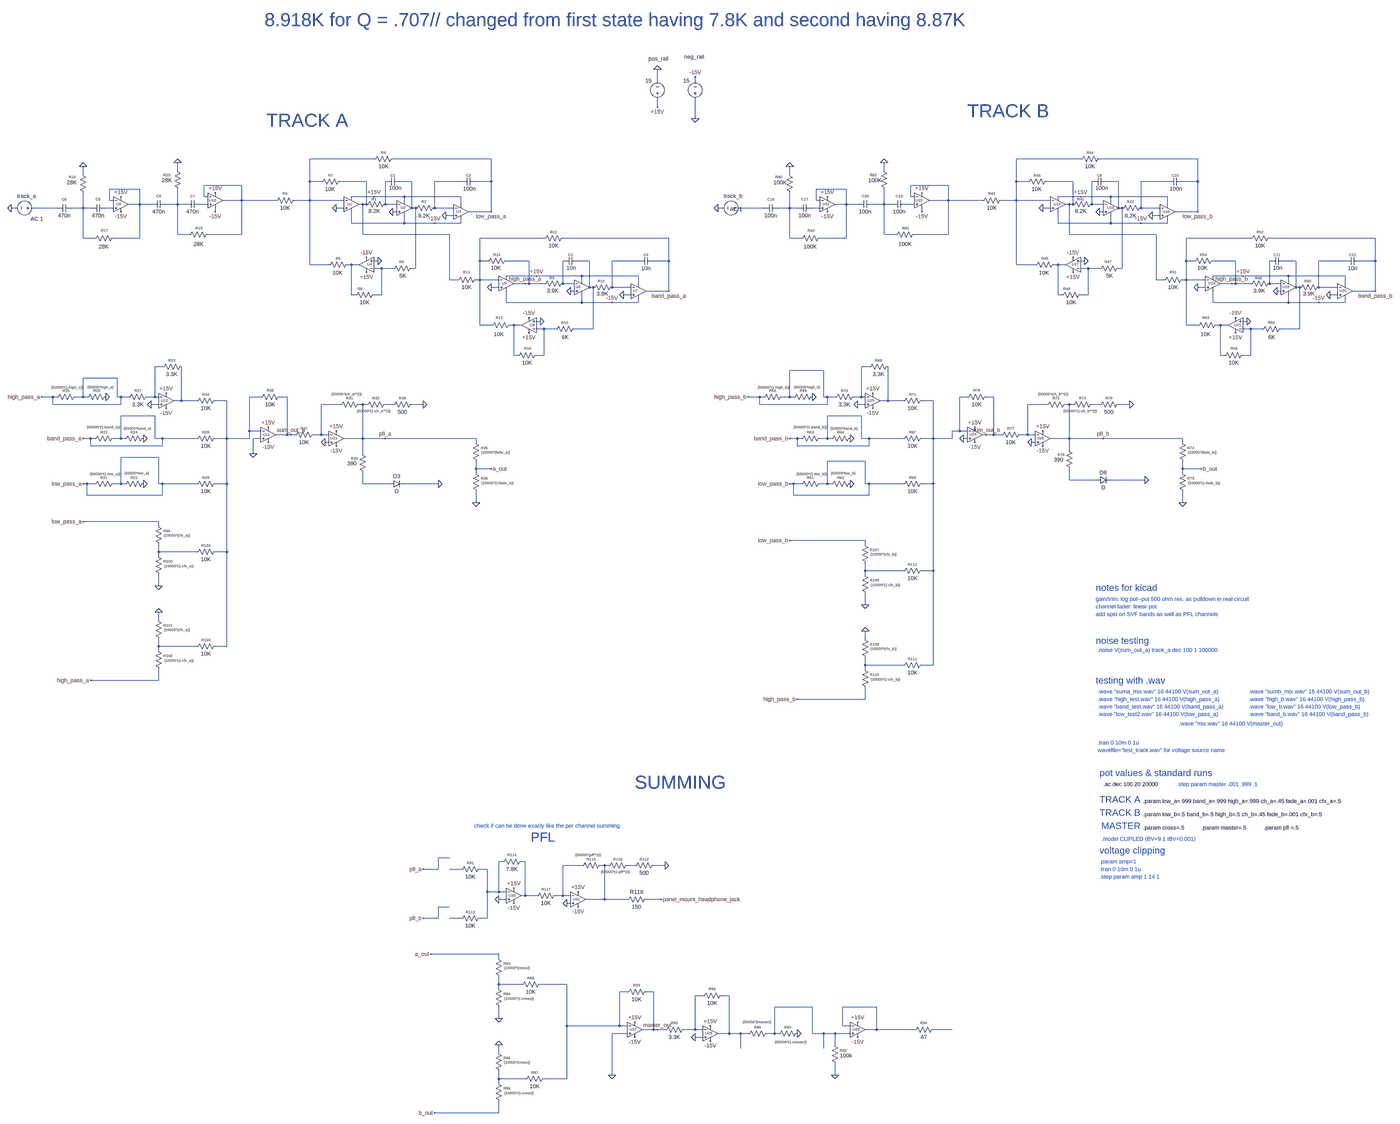
[diagram p0: schematic dj_mixer.asc, whole sheet]
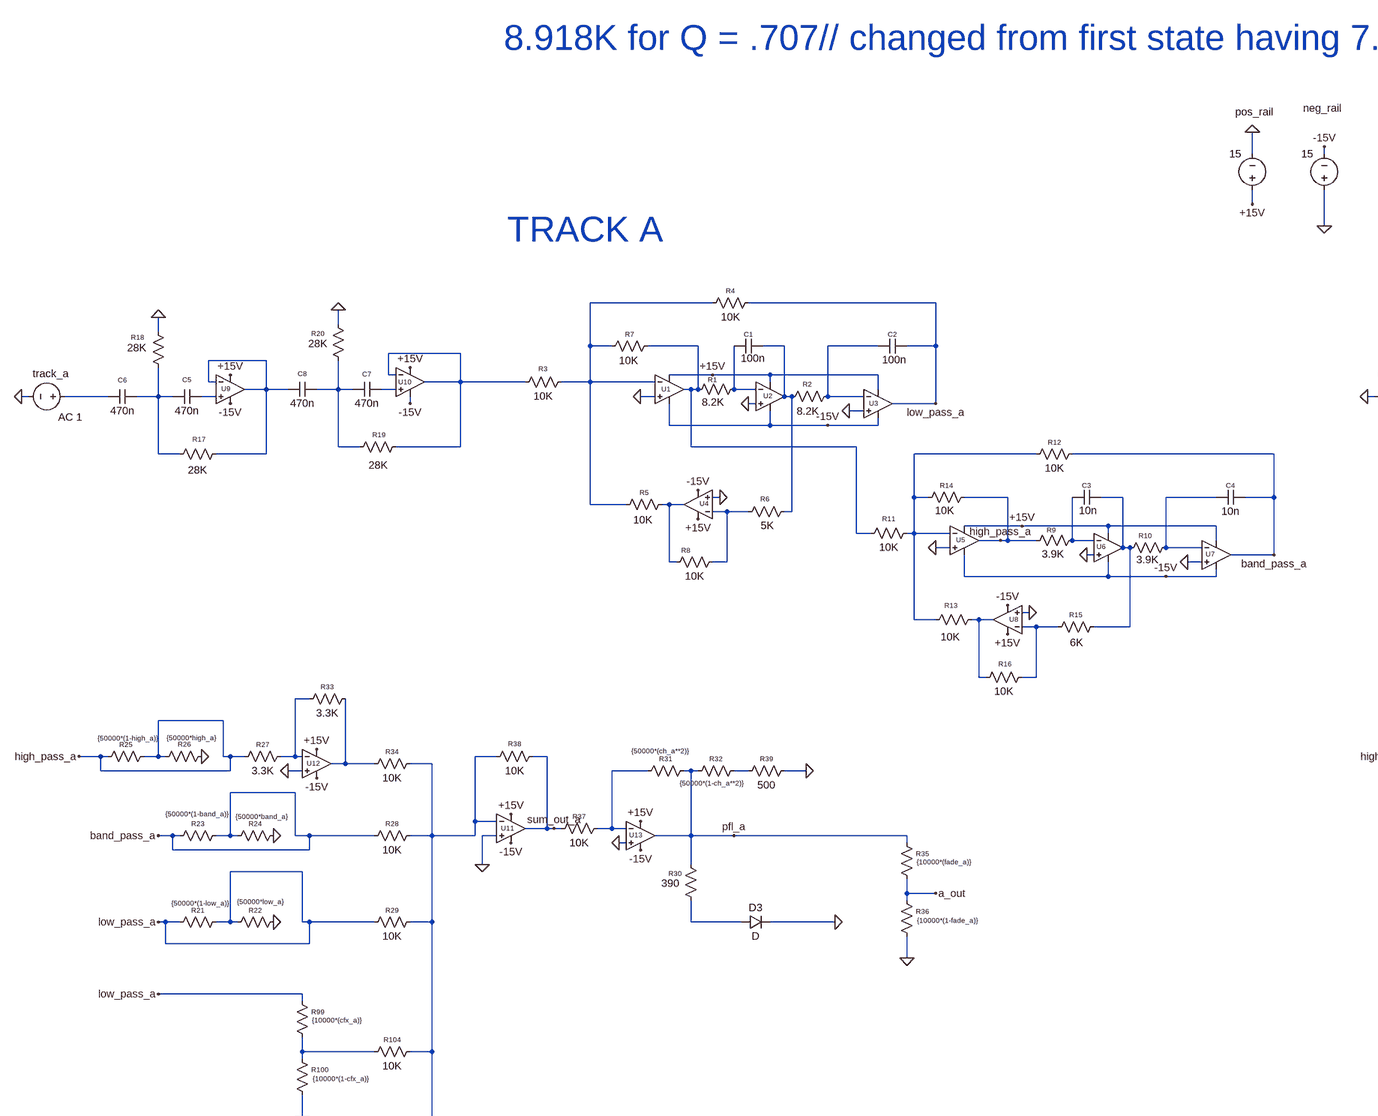
[diagram p1: schematic dj_mixer.asc, part, row 1 of 2, column 1 of 2]
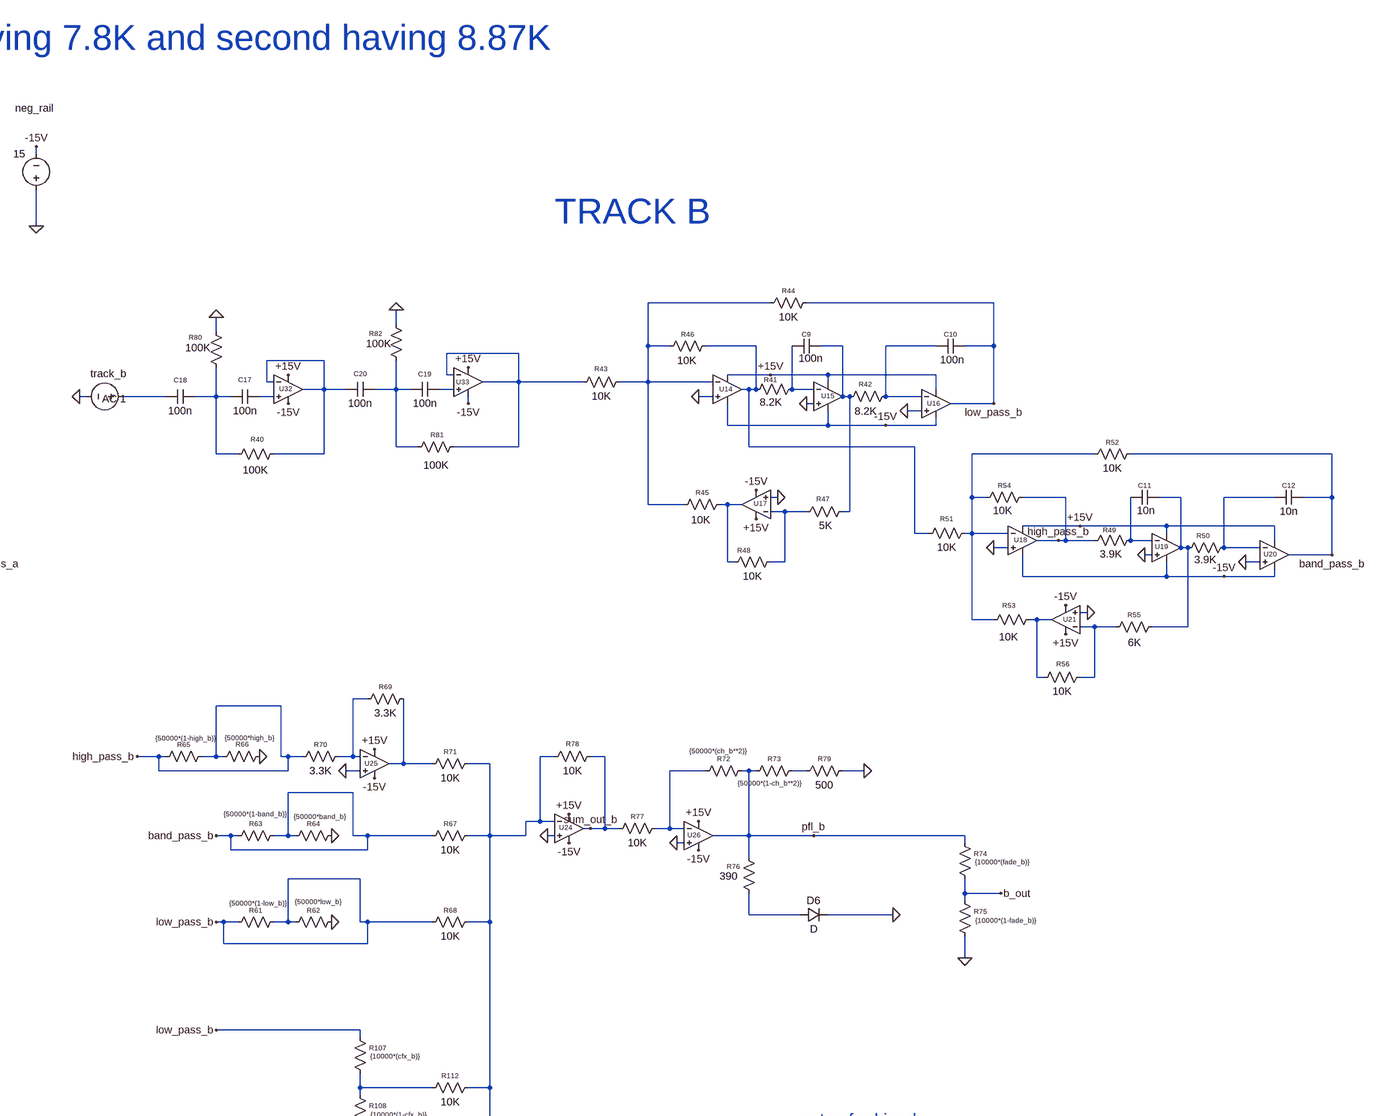
[diagram p2: schematic dj_mixer.asc, part, row 1 of 2, column 2 of 2]
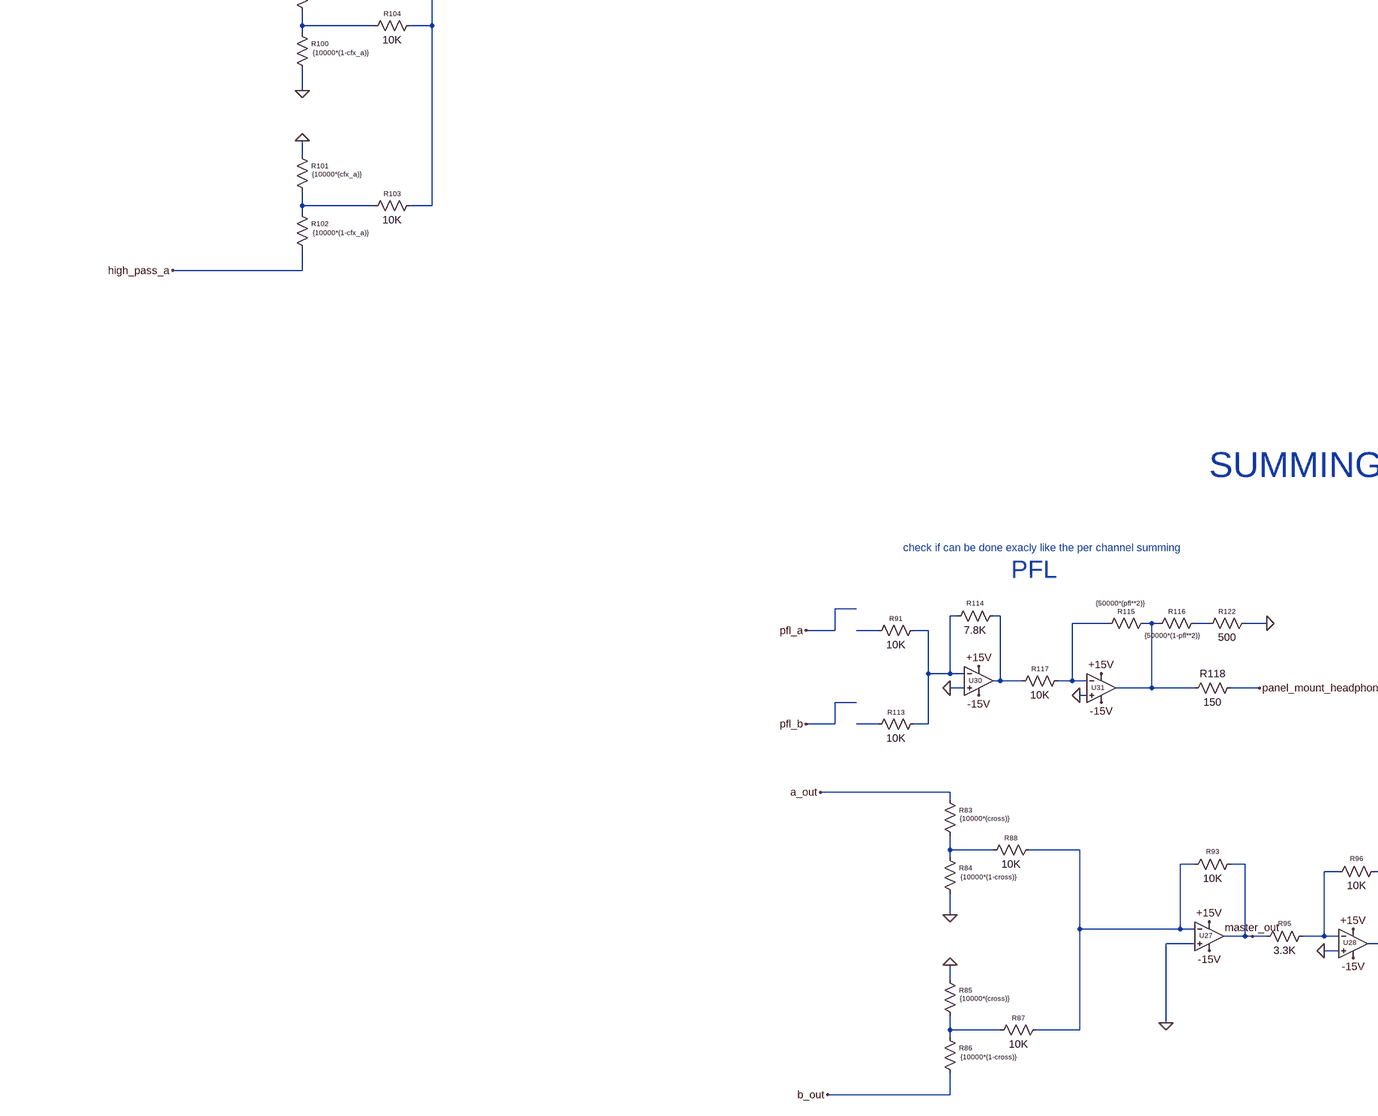
[diagram p3: schematic dj_mixer.asc, part, row 2 of 2, column 1 of 2]
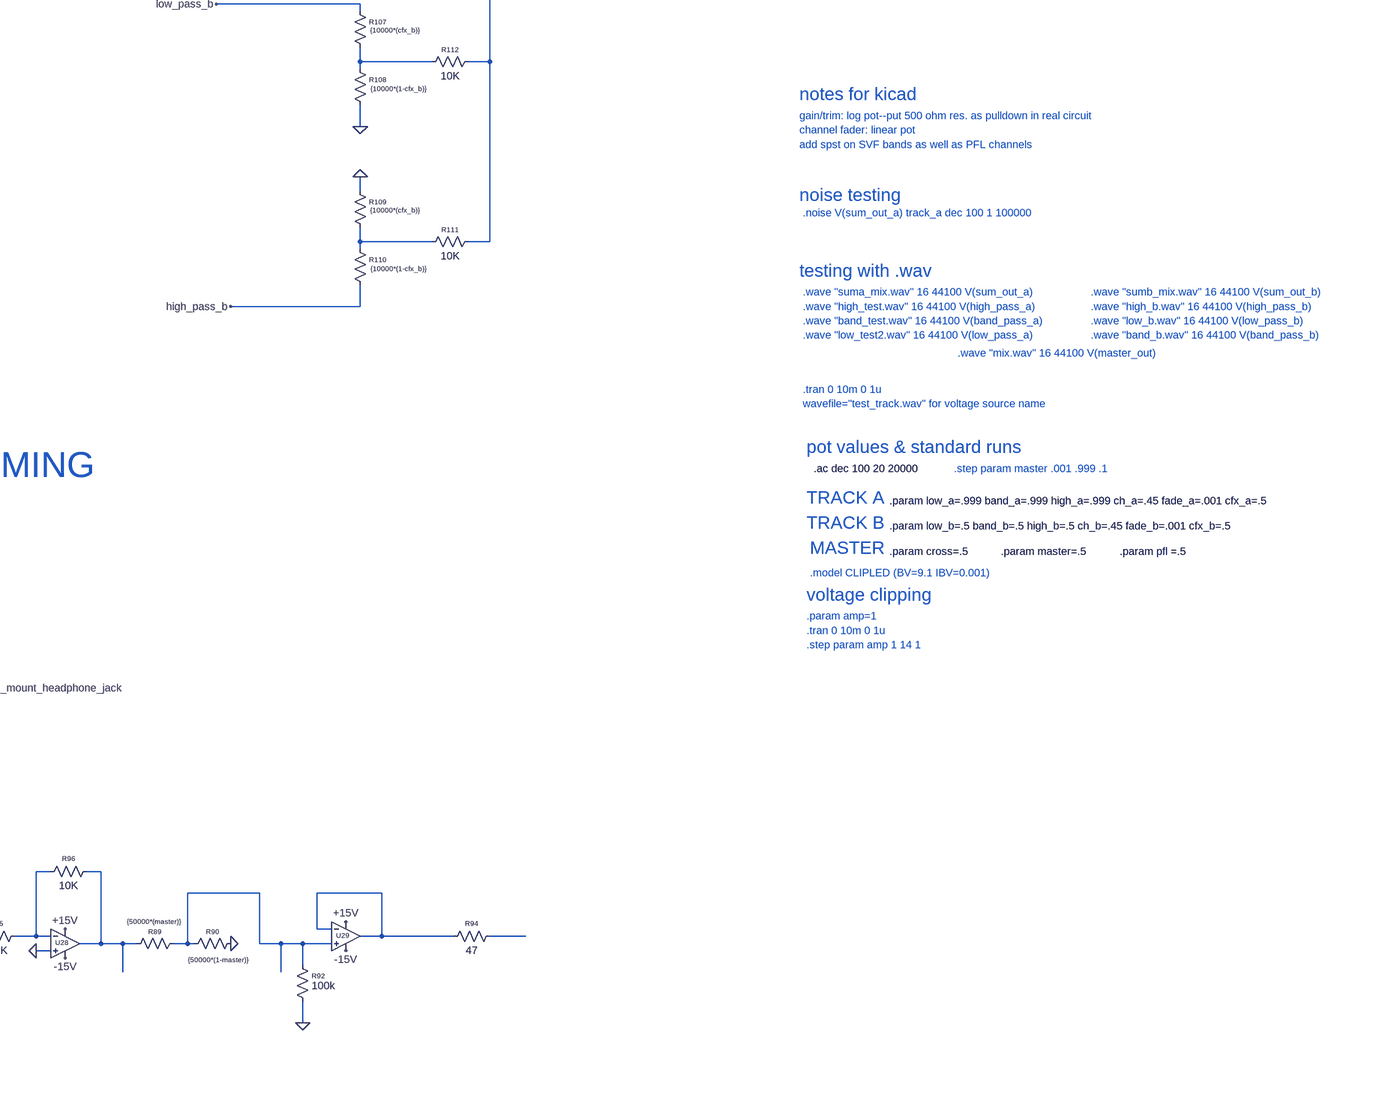
[diagram p4: schematic dj_mixer.asc, part, row 2 of 2, column 2 of 2]
* dj_mixer.asc
X§U1 0 N001 +15V -15V N003 level2 Avol=200K GBW=10Meg Slew=9Meg Ilimit=30m Rail=0 En=0 Enk=0 In=0 Ink=0 Rin=500Meg  ; pins In+ In- V+ V- OUT
X§U2 0 N015 +15V -15V N004 level2 Avol=200K GBW=10Meg Slew=9Meg Ilimit=30m Rail=0 Vos=0 En=0 Enk=0 In=0 Ink=0 Rin=500Meg  ; pins In+ In- V+ V- OUT
X§U3 0 N005 +15V -15V low_pass_a level2 Avol=200K GBW=10Meg Slew=9Meg Ilimit=30m Rail=0 Vos=0 En=0 Enk=0 In=0 Ink=0 Rin=500Meg  ; pins In+ In- V+ V- OUT
X§U4 0 N033 +15V -15V N031 level2 Avol=200K GBW=10Meg Slew=9Meg Ilimit=30m Rail=0 Vos=0 En=0 Enk=0 In=0 Ink=0 Rin=500Meg  ; pins In+ In- V+ V- OUT
V§pos_rail +15V 0 15
R1 N015 N003 8.2K tol=1
R2 N005 N004 8.2K tol=1
R3 N001 N009 10K tol=1
R4 low_pass_a N001 10K tol=1
R5 N031 N001 10K tol=1
R7 N003 N001 10K tol=1
C1 N004 N015 100n
C2 low_pass_a N005 100n
R6 N004 N033 5K tol=1
R8 N033 N031 10K tol=1
V§track_a N019 0 AC 1
V§neg_rail 0 -15V 15
X§U5 0 N025 +15V -15V high_pass_a level2 Avol=200K GBW=10Meg Slew=9Meg Ilimit=30m Rail=0 En=0 Enk=0 In=0 Ink=0 Rin=500Meg  ; pins In+ In- V+ V- OUT
X§U6 0 N035 +15V -15V N027 level2 Avol=200K GBW=10Meg Slew=9Meg Ilimit=30m Rail=0 Vos=0 En=0 Enk=0 In=0 Ink=0 Rin=500Meg  ; pins In+ In- V+ V- OUT
X§U7 0 N028 +15V -15V band_pass_a level2 Avol=200K GBW=10Meg Slew=9Meg Ilimit=30m Rail=0 Vos=0 En=0 Enk=0 In=0 Ink=0 Rin=500Meg  ; pins In+ In- V+ V- OUT
X§U8 0 N039 +15V -15V N037 level2 Avol=200K GBW=10Meg Slew=9Meg Ilimit=30m Rail=0 Vos=0 En=0 Enk=0 In=0 Ink=0 Rin=500Meg  ; pins In+ In- V+ V- OUT
R9 N035 high_pass_a 3.9K tol=1
R10 N028 N027 3.9K tol=1
R11 N025 N003 10K tol=1
R12 band_pass_a N025 10K tol=1
R13 N037 N025 10K tol=1
R14 high_pass_a N025 10K tol=1
C3 N027 N035 10n
C4 band_pass_a N028 10n
R15 N027 N039 6K tol=1
R16 N039 N037 10K tol=1
X§U9 N021 N011 +15V -15V N011 level2 Avol=200K GBW=10Meg Slew=9Meg Ilimit=30m Rail=0 En=0 Enk=0 In=0 Ink=0 Rin=500Meg  ; pins In+ In- V+ V- OUT
R17 N011 N020 28K tol=1
R18 0 N020 28K tol=1
C5 N021 N020 470n
C6 N020 N019 470n
X§U10 N014 N009 +15V -15V N009 level2 Avol=200K GBW=10Meg Slew=9Meg Ilimit=30m Rail=0 En=0 Enk=0 In=0 Ink=0 Rin=500Meg  ; pins In+ In- V+ V- OUT
R19 N009 N013 28K tol=1
R20 0 N013 28K tol=1
C7 N014 N013 470n
C8 N013 N011 470n
R21 low_pass_a low_pass_a {50000*(1-low_a)} tol=1
R22 low_pass_a 0 {50000*low_a} tol=1
R23 band_pass_a band_pass_a {50000*(1-band_a)} tol=1
R24 band_pass_a 0 {50000*band_a} tol=1
R25 high_pass_a high_pass_a {50000*(1-high_a)} tol=1
R26 high_pass_a 0 {50000*high_a} tol=1
R28 N043 band_pass_a 10K tol=1
R29 N043 low_pass_a 10K tol=1
X§U11 0 N043 +15V -15V sum_out_a level2 Avol=200K GBW=10Meg Slew=9Meg Ilimit=30m Rail=0 Vos=0 En=0 Enk=0 In=0 Ink=0 Rin=500Meg  ; pins In+ In- V+ V- OUT
X§U12 0 N041 +15V -15V N045 level2 Avol=200K GBW=10Meg Slew=9Meg Ilimit=30m Rail=0 Vos=0 En=0 Enk=0 In=0 Ink=0 Rin=500Meg  ; pins In+ In- V+ V- OUT
R33 N045 N041 3.3K tol=1
R27 N041 high_pass_a 3.3K tol=1
R34 N043 N045 10K tol=1
X§U13 0 N047 +15V -15V pfl_a level2 Avol=200K GBW=10Meg Slew=9Meg Ilimit=30m Rail=0 Vos=0 En=0 Enk=0 In=0 Ink=0 Rin=500Meg  ; pins In+ In- V+ V- OUT
R31 N047 pfl_a {50000*(ch_a**2)} tol=1
R32 pfl_a N048 {50000*(1-ch_a**2)} tol=1
R35 pfl_a a_out {10000*(fade_a)} tol=1
R36 a_out 0 {10000*(1-fade_a)} tol=1
R37 N047 sum_out_a 10K tol=1
R38 N043 sum_out_a 10K tol=1
R39 0 N048 500 tol=1
X§U14 0 N002 +15V -15V N006 level2 Avol=200K GBW=10Meg Slew=9Meg Ilimit=30m Rail=0 En=0 Enk=0 In=0 Ink=0 Rin=500Meg  ; pins In+ In- V+ V- OUT
X§U15 0 N018 +15V -15V N007 level2 Avol=200K GBW=10Meg Slew=9Meg Ilimit=30m Rail=0 Vos=0 En=0 Enk=0 In=0 Ink=0 Rin=500Meg  ; pins In+ In- V+ V- OUT
X§U16 0 N008 +15V -15V low_pass_b level2 Avol=200K GBW=10Meg Slew=9Meg Ilimit=30m Rail=0 Vos=0 En=0 Enk=0 In=0 Ink=0 Rin=500Meg  ; pins In+ In- V+ V- OUT
X§U17 0 N034 +15V -15V N032 level2 Avol=200K GBW=10Meg Slew=9Meg Ilimit=30m Rail=0 Vos=0 En=0 Enk=0 In=0 Ink=0 Rin=500Meg  ; pins In+ In- V+ V- OUT
R41 N018 N006 8.2K tol=1
R42 N008 N007 8.2K tol=1
R43 N002 N010 10K tol=1
R44 low_pass_b N002 10K tol=1
R45 N032 N002 10K tol=1
R46 N006 N002 10K tol=1
C9 N007 N018 100n
C10 low_pass_b N008 100n
R47 N007 N034 5K tol=1
R48 N034 N032 10K tol=1
V§track_b N022 0 AC 1
X§U18 0 N026 +15V -15V high_pass_b level2 Avol=200K GBW=10Meg Slew=9Meg Ilimit=30m Rail=0 En=0 Enk=0 In=0 Ink=0 Rin=500Meg  ; pins In+ In- V+ V- OUT
X§U19 0 N036 +15V -15V N029 level2 Avol=200K GBW=10Meg Slew=9Meg Ilimit=30m Rail=0 Vos=0 En=0 Enk=0 In=0 Ink=0 Rin=500Meg  ; pins In+ In- V+ V- OUT
X§U20 0 N030 +15V -15V band_pass_b level2 Avol=200K GBW=10Meg Slew=9Meg Ilimit=30m Rail=0 Vos=0 En=0 Enk=0 In=0 Ink=0 Rin=500Meg  ; pins In+ In- V+ V- OUT
X§U21 0 N040 +15V -15V N038 level2 Avol=200K GBW=10Meg Slew=9Meg Ilimit=30m Rail=0 Vos=0 En=0 Enk=0 In=0 Ink=0 Rin=500Meg  ; pins In+ In- V+ V- OUT
R49 N036 high_pass_b 3.9K tol=1
R50 N030 N029 3.9K tol=1
R51 N026 N006 10K tol=1
R52 band_pass_b N026 10K tol=1
R53 N038 N026 10K tol=1
R54 high_pass_b N026 10K tol=1
C11 N029 N036 10n
C12 band_pass_b N030 10n
R55 N029 N040 6K tol=1
R56 N040 N038 10K tol=1
R61 low_pass_b low_pass_b {50000*(1-low_b)} tol=1
R62 low_pass_b 0 {50000*low_b} tol=1
R63 band_pass_b band_pass_b {50000*(1-band_b)} tol=1
R64 band_pass_b 0 {50000*band_b} tol=1
R65 high_pass_b high_pass_b {50000*(1-high_b)} tol=1
R66 high_pass_b 0 {50000*high_b} tol=1
R67 N044 band_pass_b 10K tol=1
R68 N044 low_pass_b 10K tol=1
X§U24 0 N044 +15V -15V sum_out_b level2 Avol=200K GBW=10Meg Slew=9Meg Ilimit=30m Rail=0 Vos=0 En=0 Enk=0 In=0 Ink=0 Rin=500Meg  ; pins In+ In- V+ V- OUT
X§U25 0 N042 +15V -15V N046 level2 Avol=200K GBW=10Meg Slew=9Meg Ilimit=30m Rail=0 Vos=0 En=0 Enk=0 In=0 Ink=0 Rin=500Meg  ; pins In+ In- V+ V- OUT
R69 N046 N042 3.3K tol=1
R70 N042 high_pass_b 3.3K tol=1
R71 N044 N046 10K tol=1
X§U26 0 N049 +15V -15V pfl_b level2 Avol=200K GBW=10Meg Slew=9Meg Ilimit=30m Rail=0 Vos=0 En=0 Enk=0 In=0 Ink=0 Rin=500Meg  ; pins In+ In- V+ V- OUT
R72 N049 pfl_b {50000*(ch_b**2)} tol=1
R73 pfl_b N050 {50000*(1-ch_b**2)} tol=1
R74 pfl_b b_out {10000*(fade_b)} tol=1
R75 b_out 0 {10000*(1-fade_b)} tol=1
R77 N049 sum_out_b 10K tol=1
R78 N044 sum_out_b 10K tol=1
R79 0 N050 500 tol=1
R83 a_out N064 {10000*(cross)} tol=1
R84 N064 0 {10000*(1-cross)} tol=1
R85 0 N071 {10000*(cross)} tol=1
R86 N071 b_out {10000*(1-cross)} tol=1
R87 N065 N071 10K tol=1
R88 N065 N064 10K tol=1
X§U27 0 N065 +15V -15V master_out level2 Avol=200K GBW=10Meg Slew=9Meg Ilimit=30m Rail=0 Vos=0 En=0 Enk=0 In=0 Ink=0 Rin=500Meg  ; pins In+ In- V+ V- OUT
R93 N065 master_out 10K tol=1
X§U28 0 N066 +15V -15V N067 level2 Avol=200K GBW=10Meg Slew=9Meg Ilimit=30m Rail=0 Vos=0 En=0 Enk=0 In=0 Ink=0 Rin=500Meg  ; pins In+ In- V+ V- OUT
R89 N067 N068 {50000*(master)} tol=1
R90 N068 0 {50000*(1-master)} tol=1
R92 N068 0 100k tol=1
X§U29 N068 N069 +15V -15V N069 level2 Avol=200K GBW=10Meg Slew=9Meg Ilimit=30m Rail=0 Vos=0 En=0 Enk=0 In=0 Ink=0 Rin=500Meg  ; pins In+ In- V+ V- OUT
R94 N069 N070 47 tol=1
R95 master_out N066 3.3K tol=1
R96 N066 N067 10K tol=1
R99 low_pass_a N053 {10000*(cfx_a)} tol=1
R100 N053 0 {10000*(1-cfx_a)} tol=1
R101 0 N055 {10000*(cfx_a)} tol=1
R102 N055 high_pass_a {10000*(1-cfx_a)} tol=1
R103 N043 N055 10K tol=1
R104 N043 N053 10K tol=1
R107 low_pass_b N054 {10000*(cfx_b)} tol=1
R108 N054 0 {10000*(1-cfx_b)} tol=1
R109 0 N056 {10000*(cfx_b)} tol=1
R110 N056 high_pass_b {10000*(1-cfx_b)} tol=1
R111 N044 N056 10K tol=1
R112 N044 N054 10K tol=1
R30 N052 pfl_a 390 tol=1
D3 N052 0 D
R76 N051 pfl_b 390 tol=1
D6 N051 0 D
R91 N057 N062 10K tol=1
R113 N057 N063 10K tol=1
X§U30 0 N057 +15V -15V N058 level2 Avol=200K GBW=10Meg Slew=9Meg Ilimit=30m Rail=0 Vos=0 En=0 Enk=0 In=0 Ink=0 Rin=500Meg  ; pins In+ In- V+ V- OUT
R114 N057 N058 7.8K tol=1
R115 N059 N060 {50000*(pfl**2)} tol=1
R116 N060 N061 {50000*(1-pfl**2)} tol=1
R117 N059 N058 10K tol=1
R122 0 N061 500 tol=1
X§U31 0 N059 +15V -15V N060 level2 Avol=200K GBW=10Meg Slew=9Meg Ilimit=30m Rail=0 Vos=0 En=0 Enk=0 In=0 Ink=0 Rin=500Meg  ; pins In+ In- V+ V- OUT
R118 panel_mount_headphone_jack N060 150
X§U32 N024 N012 +15V -15V N012 level2 Avol=200K GBW=10Meg Slew=9Meg Ilimit=30m Rail=0 En=0 Enk=0 In=0 Ink=0 Rin=500Meg  ; pins In+ In- V+ V- OUT
R40 N012 N023 100K tol=1
R80 0 N023 100K tol=1
C17 N024 N023 100n
C18 N023 N022 100n
X§U33 N017 N010 +15V -15V N010 level2 Avol=200K GBW=10Meg Slew=9Meg Ilimit=30m Rail=0 En=0 Enk=0 In=0 Ink=0 Rin=500Meg  ; pins In+ In- V+ V- OUT
R81 N010 N016 100K tol=1
R82 0 N016 100K tol=1
C19 N017 N016 100n
C20 N016 N012 100n
.model D D
.lib standard.dio
.ac dec 100 20 20000
.param low_a=.999 band_a=.999 high_a=.999 ch_a=.45 fade_a=.001 cfx_a=.5
* gain/trim: log pot--put 500 ohm res. as pulldown in real circuit
* channel fader: linear pot
* .wave "band_test.wav" 16 44100 V(band_pass_a)
* .tran 0 10m 0 1u
* .wave "low_test2.wav" 16 44100 V(low_pass_a)
* .wave "high_test.wav" 16 44100 V(high_pass_a)
* .wave "suma_mix.wav" 16 44100 V(sum_out_a)
* .noise V(sum_out_a) track_a dec 100 1 100000
* wavefile="test_track.wav" for voltage source name
* pot values & standard runs
* testing with .wav
* noise testing
* TRACK A
* TRACK B
.param low_b=.5 band_b=.5 high_b=.5 ch_b=.45 fade_b=.001 cfx_b=.5
.param cross=.5
.param master=.5
* MASTER
* .wave "low_b.wav" 16 44100 V(low_pass_b)
* .wave "band_b.wav" 16 44100 V(band_pass_b)
* .wave "high_b.wav" 16 44100 V(high_pass_b)
* .wave "sumb_mix.wav" 16 44100 V(sum_out_b)
* .wave "mix.wav" 16 44100 V(master_out)
* .step param master .001 .999 .1
* .tran 0 10m 0 1u
* .param amp=1
* .step param amp 1 14 1
* voltage clipping
* .model CLIPLED (BV=9.1 IBV=0.001)
* PFL
* add spst on SVF bands as well as PFL channels
* notes for kicad
* check if can be done exacly like the per channel summing
* TRACK A
* TRACK B
* SUMMING
* 8.918K for Q = .707// changed from first state having 7.8K and second having 8.87K
.param pfl =.5
.lib UniversalOpAmp2.lib
.backanno
.end